# Altium schematic sheet Led.schdoc
size 44 x 31 mm
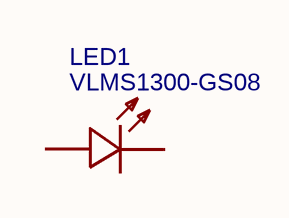
[diagram p0: Led.schdoc]

## Parts
LED1  VLMS1300-GS08  [LED0603-R-RD_RED]

## Nets

Not connected (* = marked no-connect by the designer): LED1 1(A) 2(C)

## Library data of the parts
LED1 = VLMS1300-GS08: Manufacturer: VISHAY(威世); Contributor: LCSC; Supplier: LCSC; Supplier Part: C83242; Manufacturer Part: VLMS1300-GS08; JLCPCB Part Class: Extended Part; spicePre: L; spiceSymbolName: VLMS1300-GS08